# Altium project Motor_Board.PrjPcb
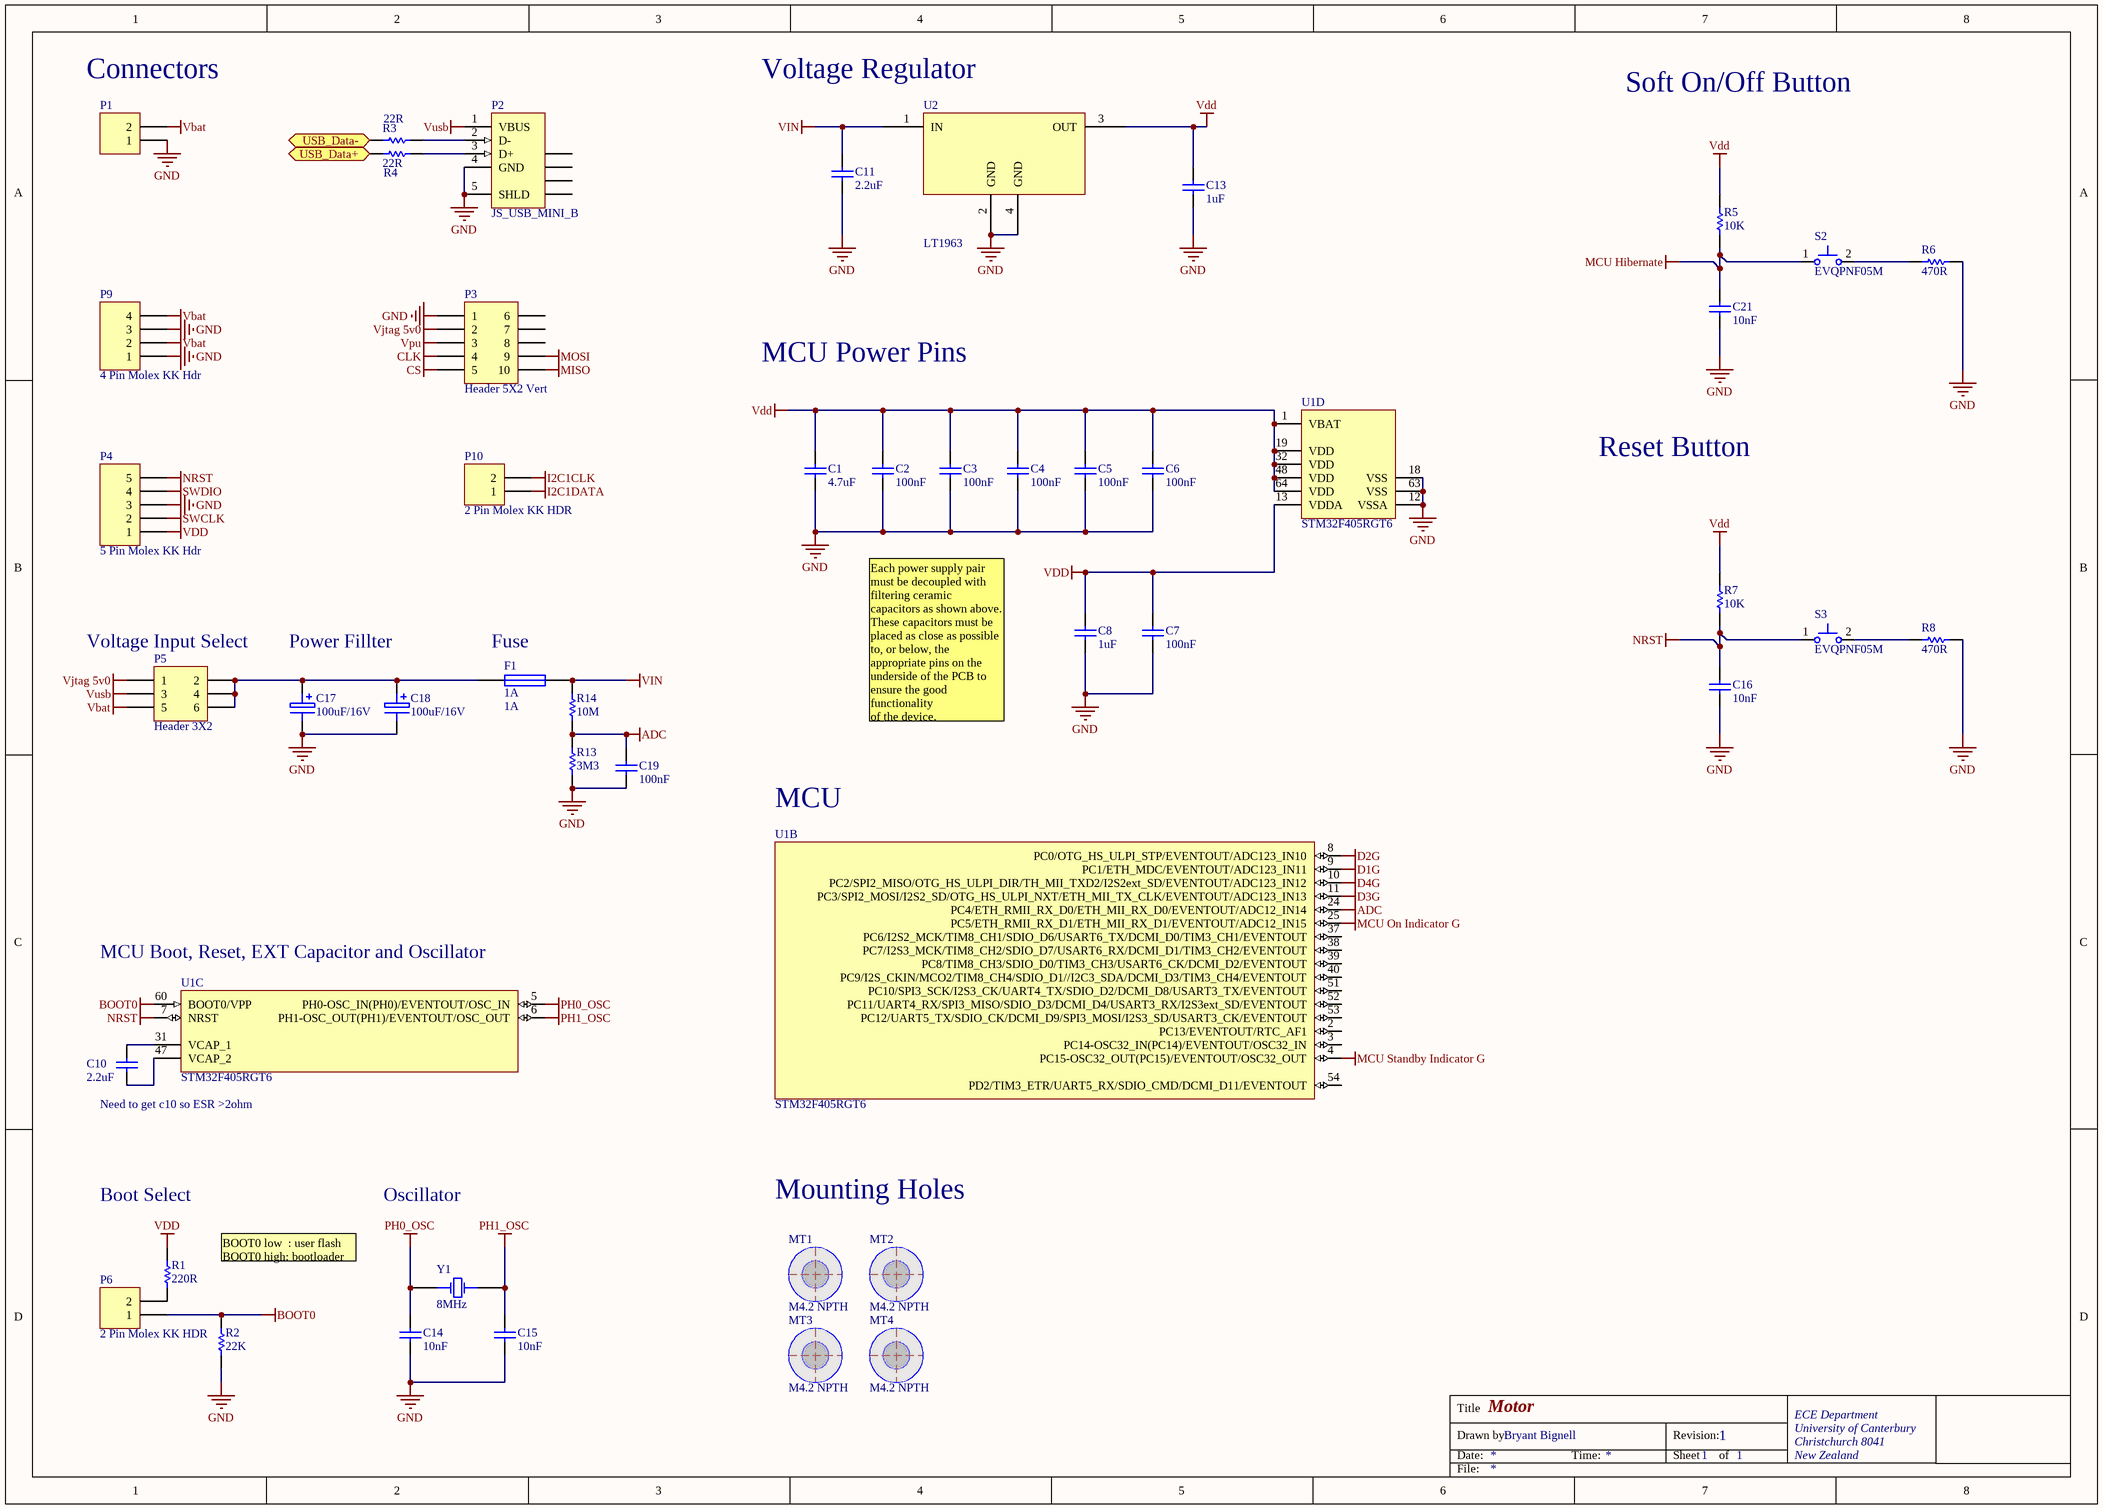
[diagram p0: MotorBoard.SchDoc]
1 sheet, 46 parts. Net scope: flat (ports and power ports of the same name join across sheets).

## Sheet MotorBoard.SchDoc: Motor
size A3; DrawnBy: Bryant Bignell; Address1: ECE Department; Address2: University of Canterbury; Address3: Christchurch 8041; Address4: New Zealand; Revision: 1; SheetNumber: 1; SheetTotal: 1; PageSetup: Record=PageOptions|CenterHorizontal=True|CenterVertical=True|PrintScale=1.01|XCorrection=1.00|YCorrection=1.00|PrintKind=1|BorderSize=5000000|LeftOffset=0|BottomOffset=0|Orientation=2|PaperLength=1000|PaperWidth=1000|Scale=100|PaperSource=15|PrintQuality=600|MediaType=1|DitherType=10|PaperKind=A3|PrintScaleMode=1

### Parts
C1  4.7uF  [CAPC2012L]
C2  100nF  [CAPC1005L]
C3  100nF  [CAPC1005L]
C4  100nF  [CAPC1005L]
C5  100nF  [CAPC1005L]
C6  100nF  [CAPC1005L]
C7  100nF  [CAPC1005L]
C8  1uF  [CAPC1608L]
C10  2.2uF  [14-1210]
C11  2.2uF  [CAPC2012L]
C13  1uF  [CAPC1608L]
C14  10nF  [CAPC1608L]
C15  10nF  [CAPC1608L]
C16  10nF  [CAPC1608L]
C17  100uF/16V  [NICH-1]
C18  100uF/16V  [NICH-1]
C19  100nF  [CAPC1608L]
C21  10nF  [CAPC1608L]
F1  1A  [RESC3216N]
MT1  M4.2 NPTH  [MNT-HOLE_4.2mm_NPTH]  (no BOM)
MT2  M4.2 NPTH  [MNT-HOLE_4.2mm_NPTH]  (no BOM)
MT3  M4.2 NPTH  [MNT-HOLE_4.2mm_NPTH]  (no BOM)
MT4  M4.2 NPTH  [MNT-HOLE_4.2mm_NPTH]  (no BOM)
P1  (no value)  [MOLEX_KK_2_HDR]
P2  JS_USB_MINI_B  [USB/SM0.8-6H5]
P3  Header 5X2 Vert  [IDC2.54-V10D]
P4  5 Pin Molex KK Hdr  [MOLEX_KK_5_HDR]
P5  Header 3X2  [HDR2X3]
P6  2 Pin Molex KK HDR  [MOLEX_KK_2_HDR]
P9  4 Pin Molex KK Hdr  [MOLEX_KK_4_HDR]
P10  2 Pin Molex KK HDR  [MOLEX_KK_2_HDR]
R1  220R  [RESC1608L]
R2  22K  [RESC1608L]
R3  22R  [RESC1608L]
R4  22R  [RESC1608L]
R5  10K  [RESC1608L]
R6  470R  [RESC1608L]
R7  10K  [RESC1608L]
R8  470R  [RESC1608L]
R13  3M3  [RESC1608L]
R14  10M  [RESC1608L]
S2  EVQPNF05M  [EVQPNF05M]
S3  EVQPNF05M  [EVQPNF05M]
U1  STM32F405RGT6  [TQFP64_V]  (parts B,C,D of 4)
U2  LT1963  [SOT223-4M]
Y1  8MHz  [HC49/4h_SMX]

### Ports
USB_Data+ (bidir), USB_Data- (bidir)

### Nets
ADC: C19.1 R13.2 R14.1 U1.24(PC4/ETH_RMII_RX_D0/ETH_MII_RX_D0/EVENTOUT/ADC12_IN14)
BOOT0: P6.1 R2.2 U1.60(BOOT0/VPP)
CLK: P3.4
CS: P3.5
D1G: U1.9(PC1/ETH_MDC/EVENTOUT/ADC123_IN11)
D2G: U1.8(PC0/OTG_HS_ULPI_STP/EVENTOUT/ADC123_IN10)
D3G: U1.11(PC3/SPI2_MOSI/I2S2_SD/OTG_HS_ULPI_NXT/ETH_MII_TX_CLK/EVENTOUT/ADC123_IN13)
D4G: U1.10(PC2/SPI2_MISO/OTG_HS_ULPI_DIR/TH_MII_TXD2/I2S2ext_SD/EVENTOUT/ADC123_IN12)
GND: C1.1 C2.1 C3.1 C4.1 C5.1 C6.1 C7.1 C8.1 C11.2 C13.1 C14.1 C15.1 C16.1 C17.1 C18.1 C19.2 C21.1 P1.1 P2.4(GND) P2.5(SHLD) P3.1 P4.3 P9.1 P9.3 R2.1 R6.2 R8.2 R13.1 U1.12(VSSA) U1.18(VSS) U1.63(VSS) U2.2(GND) U2.4(GND)
I2C1CLK: P10.2
I2C1DATA: P10.1
MCU Hibernate: C21.2 R5.1 S2.1
MCU On Indicator G: U1.25(PC5/ETH_RMII_RX_D1/ETH_MII_RX_D1/EVENTOUT/ADC12_IN15)
MCU Standby Indicator G: U1.4(PC15-OSC32_OUT(PC15)/EVENTOUT/OSC32_OUT)
MISO: P3.10
MOSI: P3.9
NRST: C16.2 P4.5 R7.1 S3.1 U1.7(NRST)
PH0_OSC: C14.2 U1.5(PH0-OSC_IN(PH0)/EVENTOUT/OSC_IN) Y1.1(OSC1)
PH1_OSC: C15.2 U1.6(PH1-OSC_OUT(PH1)/EVENTOUT/OSC_OUT) Y1.2(OSC2)
SWCLK: P4.2
SWDIO: P4.4
Vbat: P1.2 P5.5 P9.2 P9.4
Vdd: C1.2 C2.2 C3.2 C4.2 C5.2 C6.2 C7.2 C8.2 C13.2 P4.1 R1.2 R5.2 R7.2 U1.1(VBAT) U1.13(VDDA) U1.19(VDD) U1.32(VDD) U1.48(VDD) U1.64(VDD) U2.3(OUT)
VIN: C11.1 F1.2 R14.2 U2.1(IN)
Vjtag 5v0: P3.2 P5.1
Vpu: P3.3
Vusb: P2.1(VBUS) P5.3
NetC10_1: C10.1 U1.31(VCAP_1)
NetC10_2: C10.2 U1.47(VCAP_2)
NetC17_2: C17.2 C18.2 F1.1 P5.2 P5.4 P5.6
NetP2_2: P2.2(D-) R3.2
NetP2_3: P2.3(D+) R4.2
NetP6_2: P6.2 R1.1
NetR3_1: R3.1 ; port USB_Data-
NetR4_1: R4.1 ; port USB_Data+
NetR6_1: R6.1 S2.2
NetR8_1: R8.1 S3.2

Not connected (* = marked no-connect by the designer): P2 6(SHLD) 7(SHLD) 8(SHLD) 9(SHLD); P3 6 7 8; U1 2(PC13/EVENTOUT/RTC_AF1) 3(PC14-OSC32_IN(PC14)/EVENTOUT/OSC32_IN) 37(PC6/I2S2_MCK/TIM8_CH1/SDIO_D6/USART6_TX/DCMI_D0/TIM3_CH1/EVENTOUT) 38(PC7/I2S3_MCK/TIM8_CH2/SDIO_D7/USART6_RX/DCMI_D1/TIM3_CH2/EVENTOUT) 39(PC8/TIM8_CH3/SDIO_D0/TIM3_CH3/USART6_CK/DCMI_D2/EVENTOUT) 40(PC9/I2S_CKIN/MCO2/TIM8_CH4/SDIO_D1//I2C3_SDA/DCMI_D3/TIM3_CH4/EVENTOUT) 51(PC10/SPI3_SCK/I2S3_CK/UART4_TX/SDIO_D2/DCMI_D8/USART3_TX/EVENTOUT) 52(PC11/UART4_RX/SPI3_MISO/SDIO_D3/DCMI_D4/USART3_RX/I2S3ext_SD/EVENTOUT) 53(PC12/UART5_TX/SDIO_CK/DCMI_D9/SPI3_MOSI/I2S3_SD/USART3_CK/EVENTOUT) 54(PD2/TIM3_ETR/UART5_RX/SDIO_CMD/DCMI_D11/EVENTOUT)

### Notes on the sheet
- (near P1) Connectors
- (near U2) Voltage Regulator
- Soft On/Off Button
- MCU Power Pins
- Reset Button
- (near P5) Voltage Input Select
- Power Fillter
- (near F1) Fuse
- Each power supply pair must be decoupled with filtering ceramic capacitors as shown above. These capacitors must be
  placed as close as possible to, or below, the appropriate pins on the underside of the PCB to ensure the good functionality
  of the device.
- MCU
- (near U1) MCU Boot, Reset, EXT Capacitor and Oscillator
- Need to get c10 so ESR >2ohm
- Boot Select
- BOOT0 low  : user flash
  BOOT0 high: bootloader
- Oscillator
- Mounting Holes
- Title
- Drawn by:
- Date:
- Time:
- Revision:
- Sheet
- of
- File:

### Library data of the parts
C1 = CC_4.7uF_0805: CAP CER 4.7uF Y5V -20% +80% 16V 0805; Note: Footprint corresponds to dimensions for bulk cassette packaging. This case size has tightened tolerances.; PackageReference: 0805; Code_IPC: 2012[0805]; Verify: *; Supplier: ECE Dept Stock; Storage Location: Pottle; Value: 4.7uF
C2-C7 = CC_100nF_0402: CAP CER 100nF X7R +-10% 16V 0402; PackageReference: 0402; Code_IPC: 1005 [0402]; Verify: *; Supplier: ECE Dept Stock; Storage Location: Pottle; Value: 100nF
C8 C13 = CC_1uF_0603: CAP CER 1uF Y5V -20% +80% 16V 0603; PackageReference: 0603; Code_IPC: 1608 [0603]; Verify: *; Supplier: ECE Dept Stock; Storage Location: Pottle; Value: 1uF
C10 C11 = CC_2.2uF_0805: CAP CER 2.2uF Y5V -20% +80% 25V 0805; Note: Footprint corresponds to dimensions for bulk cassette packaging. This case size has tightened tolerances.; Code_IPC: 2012[0805]; Verify: *; Supplier: ECE Dept Stock; Storage Location: Pottle; Value: 2.2uF
  C10: PackageReference: 1210
  C11: PackageReference: 0805
C14-C16 C21 = CC_10nF_0603: CAP CER 10nF X7R +-10% 50V 0603; PackageReference: 0603; Code_IPC: 1608 [0603]; Verify: *; Supplier: ECE Dept Stock; Storage Location: Pottle; Value: 10nF
C17 C18 = CA_100uF_16V_SMD: Nichcon WX series  SMT Aluminium Electrolytic Cap; Manufacturer PN: UWX1C101MCL1GB; Value: 100uF @ 16V; Manufacturer: Nichcon; Supplier 1: ECE Stock
C19 = CC_100nF_0603: CAP CER 100nF X7R +-10% 50V 0603; PackageReference: 0603; Code_IPC: 1608 [0603]; Verify: *; Supplier: ECE Dept Stock; Storage Location: Pottle; Value: 100nF
F1 = FS_Fuse_1.0A_SMD_1206: Fuse 1.0A Very Fast Acting 1206; Manufacturer: Multicomp; Manufacturer PN: MC12CF 001; Supplier: Lab Stock; Storage Location: *; Value: 1A
MT1-MT4 = MC_M4.2_HOLE_NPT: Fixing M4.2 Mount Hole NPTH; Manufacturer: Hi-Q; Manufacturer PN: 4NE Series M4 Clearance; price: 0; value: M4.2 NPTH
P1 P6 P10 = JA_MOLEX_KK_2POS: CONN HEADER 2POS 2.54mm VERT_Thru Hole; Supplier 1: Farnell; Supplier Part Number 1: 1462926; Supplier 2: ECE Store
  P6 P10: Value: 2 Pin Molex KK HDR
P2 = JS_USB_MINI_B_SMT: USB 2.0, Right Angle, SMT, B Type, Receptacle, 5 Position,; Manufacturer: FCI; Manufacturer PN: 10033526-N3212MLF; Supplier 1: Farnell; Supplier Part Number 1: 1824416; Supplier 2: ECE Stock
P3 = JA_HDR_IDC_5X2_VERT: IDC Header, 2,54mm, 10-Pin, Vert; Supplier: ECE Dept Store
P4 = JA_MOLEX_KK_5POS: CONN HEADER 5POS 2.54mm VERT_Thru Hole; Manufacturer: Molex; Manufacturer PN: 22-23-2051; Supplier 1: ECE Dept Store; Value: 5 Pin Molex KK Hdr
P5 = Header 3X2: Header, 3-Pin, Dual row; LatestRevisionDate: 17-Jul-2002; LatestRevisionNote: Re-released for DXP Platform.; Publisher: Altium Limited
P9 = JA_MOLEX_KK_4POS: CONN HEADER 4POS 2.54mm VERT_Thru Hole; Manufacturer: Molex; Manufacturer PN: 22-23-2041; Supplier 1: ECE Dept Store; Value: 4 Pin Molex KK Hdr
R1 = RS_220R: RES 220 OHM 1/10W 5% 0603 SMD; Storage Location: ProtoPlace; Supplier: ECE Dept Stock; Value: 220R
R2 = RS_22K: RES 22.0K OHM 1/10W 5% 0603 SMD; Storage Location: ProtoPlace; Supplier: ECE Dept Stock; Value: 22K
R3 R4 = RS_22R: RES 22 OHM 1/10W 5% 0603 SMD; Storage Location: ProtoPlace; Supplier: ECE Dept Stock; Value: 22R
R5 R7 = RS_10K: RES 10.0K OHM 1/10W 5% 0603 SMD; Storage Location: ProtoPlace; Supplier: ECE Dept Stock; Value: 10K
R6 R8 = RS_470R: RES 470 OHM 1/10W 5% 0603 SMD; Storage Location: ProtoPlace; Supplier: ECE Dept Stock; Value: 470R
R13 = RS_3M3: RES 3.3M OHM 1/10W 5% 0603 SMD; Storage Location: ProtoPlace; Supplier: ECE Dept Stock; Value: 3M3
R14 = RS_10.0M: RES 10.0M OHM 1/10W 5% 0603 SMD; Storage Location: ProtoPlace; Supplier: ECE Dept Stock; Value: 10M
S2 S3 = WS_EVQPNF05M: Panasonic 6 x 3.5mm SMD Light Touch Switch Type; PackageDescription: 6.0 x 3.5 mm; Supplier 1: Farnell; Supplier Part Number 1: 2079481; Manufacturer: Panasonic; Manufacturer PN: EVQPNF05M
U1 = STM32F405RGT6: ARM Cortex-M4 32b MCU+FPU, 210DMIP, 1024 kB Flash, 192+4 kB RAM, 51 I/Os, 64-pin LQFP, -40 to +85°C, Tray; Internal RAM: 192kB; Operating Frequency (Processor Speed): 168MHz; A/D Converter: 16x12-bit; D/A Converter: 2x12-bit; 16-bit Timers (IC/OC/PWM): 12x16-bit(24/24/30); 32-bit Timer (IC/OC/PWM): 2x32-bit (8/8/8); Other Timer Functions: 2xWDG, RTC, 24-bit down counter; Serial Interface: 3xSPI/2xI2S/2xI2C/3xUSART(IrDa, ISO7816)/3xUART/1xUSB OTG FS/HS, 2xCAN/ SDIO; DatasheetVersion: rev2, Jan-2012; PackageVersion: 2012; PackageReference: TQFP64; PackageDescription: 64-Pin Low Profile Quad Flat Package, 10x10 mm Body, 0.5 mm Pitch; ComponentLink1Description: Manufacturer URL; ComponentLink1URL: http://www.st.com/; ComponentLink2Description: STM32F405/7 Datasheet; ComponentLink2URL: http://www.st.com/internet/com/TECHNICAL_RESOURCES/TECHNICAL_LITERATURE/DATASHEET/DM00037051.pdf; ComponentLink3Description: STM32F4 Web Page; ComponentLink3URL: http://www.st.com/internet/mcu/subclass/1521.jsp
Y1 = XT_8MHz_HC49/4H: CRYSTAL 8.00 MHZ 18PF SMD; Manufacturer: Abracon Corporation; Manufacturer PN: ABLS-8.000MHZ-B2-T; Supplier 1: Digi-Key; Supplier Part Number 1: 535-9089-6-ND; Value: 8MHz